# Altium schematic sheet LVDS_IFCA.SchDoc: LVDS Interface
size 420 x 297 mm; Author: G.K.; CompanyName: WUT; DrawnBy: G.K.; Organization: CERN; Address1: Warsaw Univeristy of Technology; Address2: Nowowiejska 15/19; DocumentNumber: 4; Revision: -; SheetNumber: 4; SheetTotal: 5; EDA_Number: ARTIQ; Projet: 3U ADC (Sampler); ModifiedBy: -; CreateDate: XX/XX/XXXX; CheckedDate: -; Title2: I2C logic v1.2; DivGrp: ISE; Designer: G.K.; ModifiedDate: -; ProjectName: 3U ADC (Sampler)
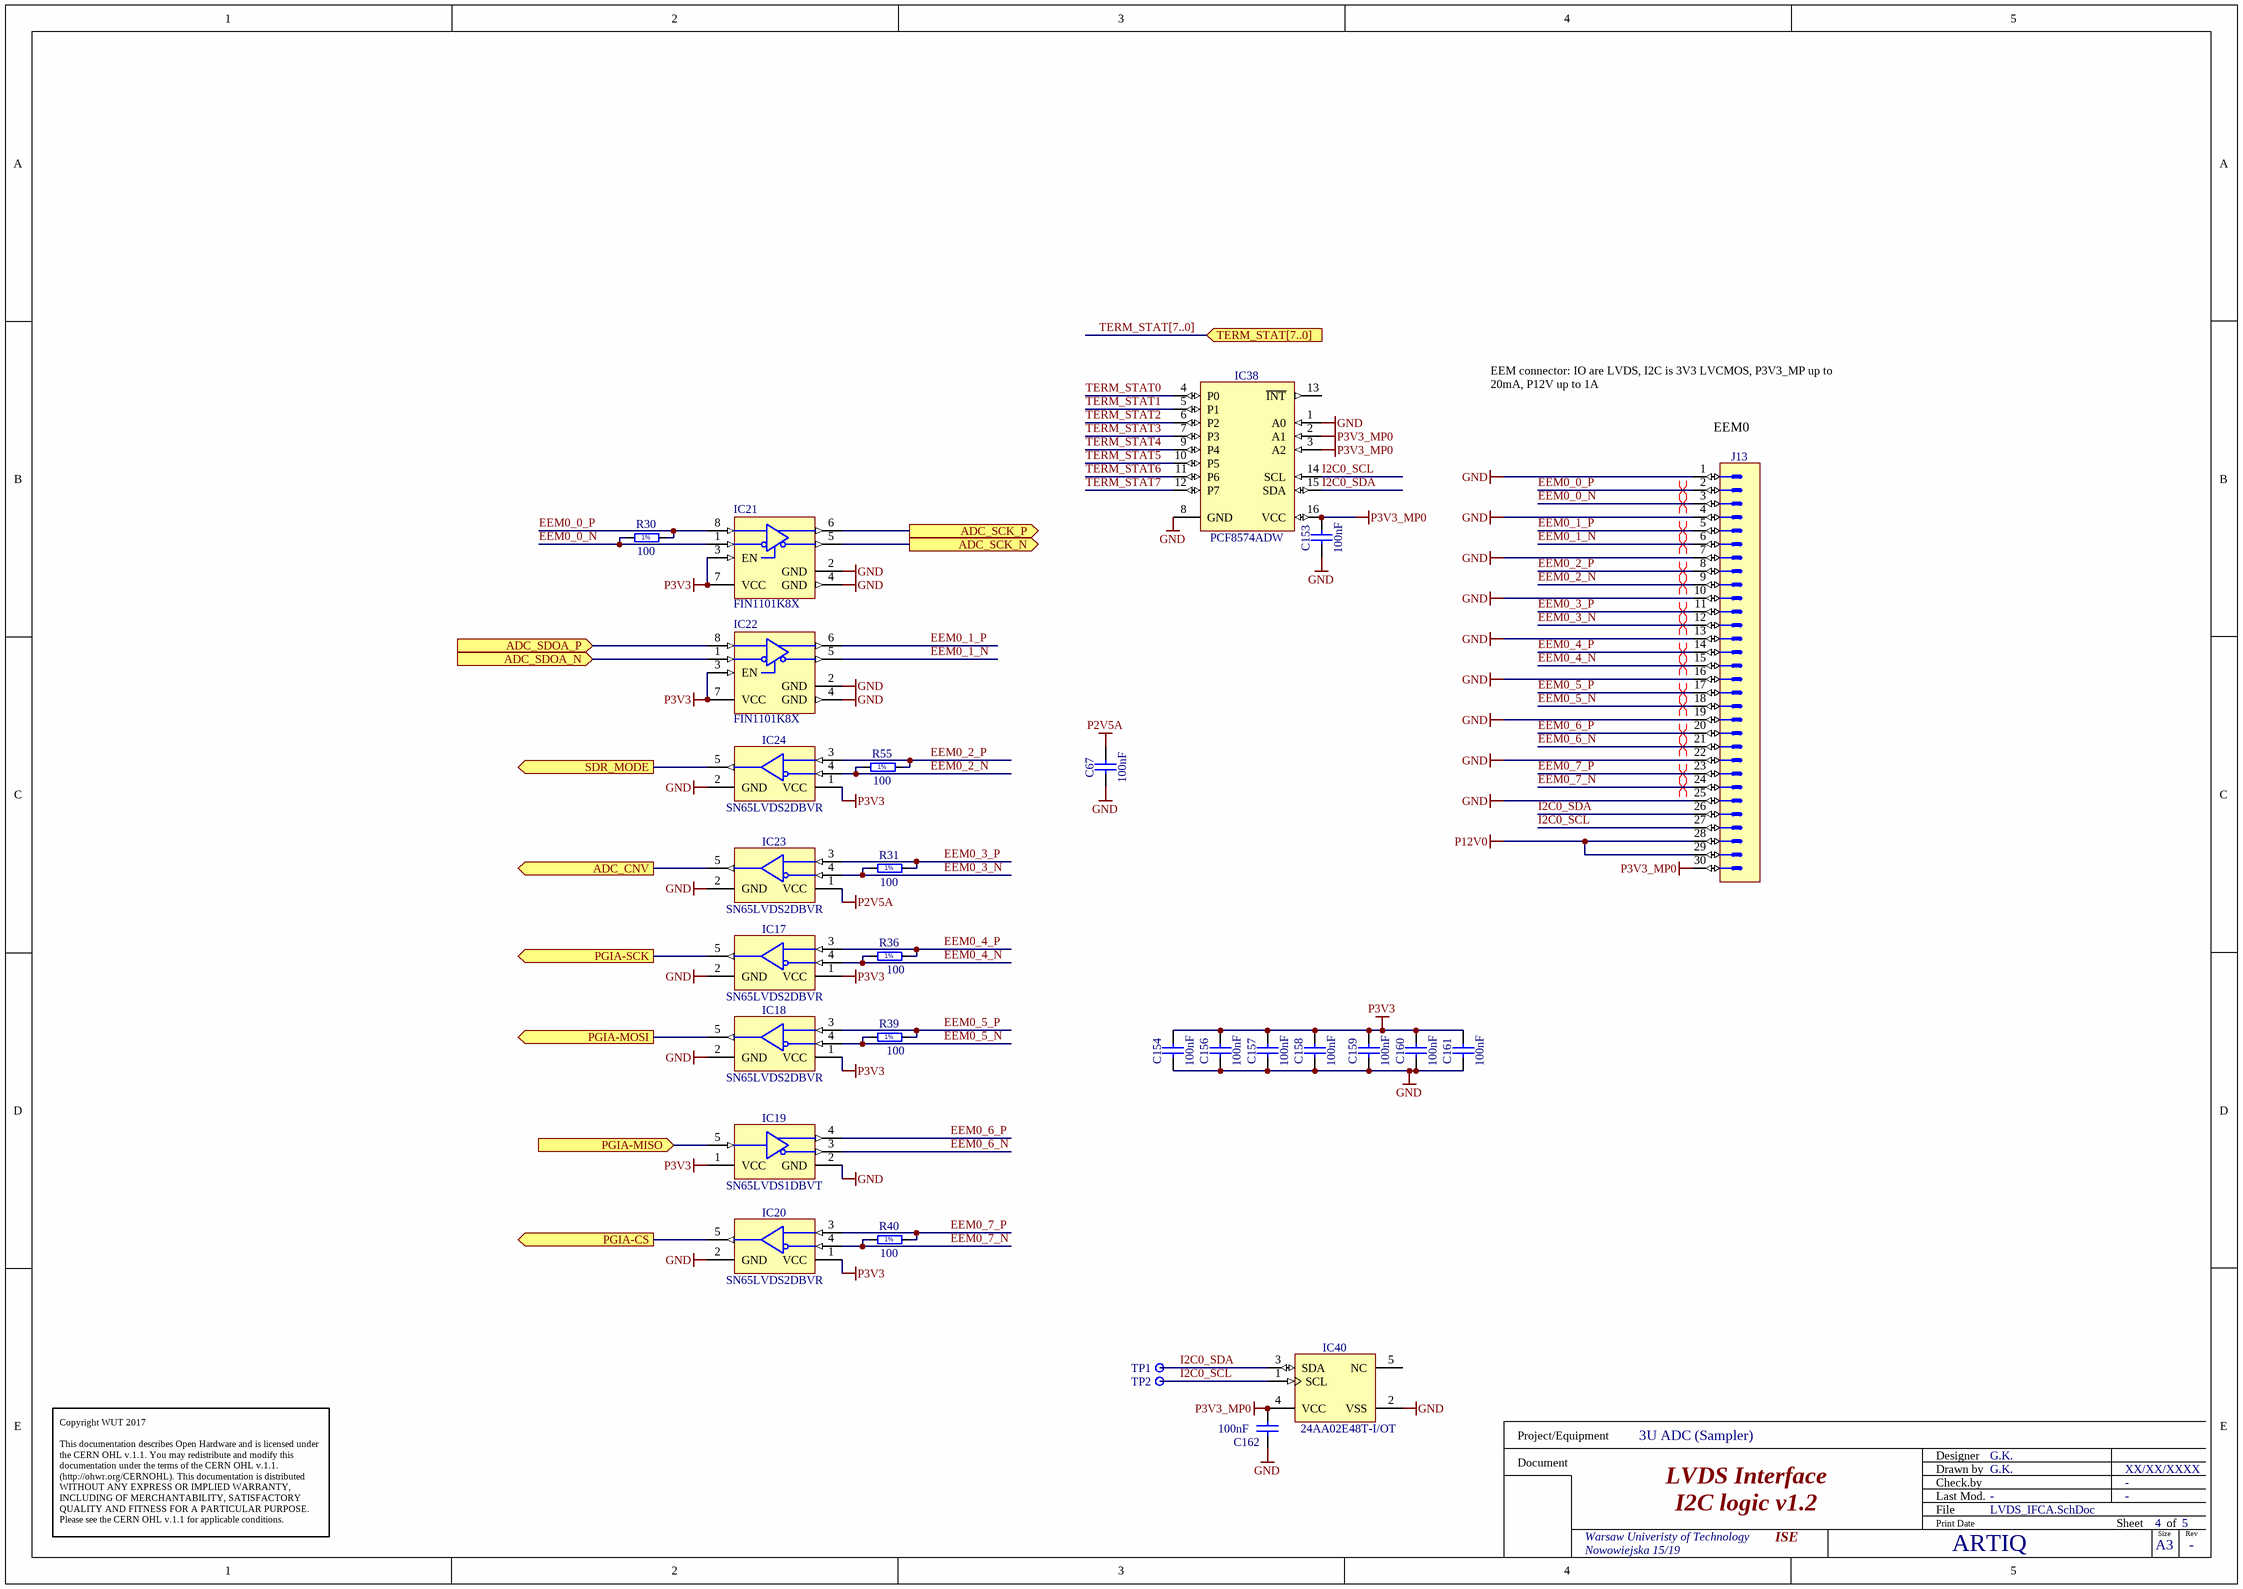
[diagram p0: LVDS_IFCA.SchDoc]

## Parts
C67  100nF  [CAPC1005X55N]
C153  100nF  [CAPC1005X55N]
C154  100nF  [CAPC1005X55N]
C156  100nF  [CAPC1005X55N]
C157  100nF  [CAPC1005X55N]
C158  100nF  [CAPC1005X55N]
C159  100nF  [CAPC1005X55N]
C160  100nF  [CAPC1005X55N]
C161  100nF  [CAPC1005X55N]
C162  100nF  [CAPC1005X55N]
IC17  SN65LVDS2DBVR  [SOT95P280X145-5N]
IC18  SN65LVDS2DBVR  [SOT95P280X145-5N]
IC19  SN65LVDS1DBVT  [SOT95P280X145-5N]
IC20  SN65LVDS2DBVR  [SOT95P280X145-5N]
IC21  FIN1101K8X  [SOP50P310X90-8N]
IC22  FIN1101K8X  [SOP50P310X90-8N]
IC23  SN65LVDS2DBVR  [SOT95P280X145-5N]
IC24  SN65LVDS2DBVR  [SOT95P280X145-5N]
IC38  PCF8574ADW  [SOIC127P1030X265-16N]
IC40  24AA02E48T-I/OT  [SOT95P280X145-5N]
J13  (no value)  [3M_N2530-6002RB]
R30  100  [RESC1005X40N]
R31  100  [RESC1005X40N]
R36  100  [RESC1005X40N]
R39  100  [RESC1005X40N]
R40  100  [RESC1005X40N]
R55  100  [RESC1005X40N]
TP1  Test Point  [TPS127]  (value not drawn)
TP2  Test Point  [TPS127]  (value not drawn)

## Ports
ADC_CNV (out), ADC_SCK_N (out), ADC_SCK_P (out), ADC_SDOA_N (in), ADC_SDOA_P (in), PGIA-CS (out), PGIA-MISO (in), PGIA-MOSI (out), PGIA-SCK (out), SDR_MODE (out), TERM_STAT[7..0] (in)

## Nets
GND: C67.1 C153.1 C154.1 C156.1 C157.1 C158.1 C159.1 C160.1 C161.1 C162.1 IC17.2(GND) IC18.2(GND) IC19.2(GND) IC20.2(GND) IC21.2(GND) IC21.4(GND) IC22.2(GND) IC22.4(GND) IC23.2(GND) IC24.2(GND) IC38.1(A0) IC38.8(GND) IC40.2(VSS) J13.1 J13.4 J13.7 J13.10 J13.13 J13.16 J13.19 J13.22 J13.25
P2V5A: C67.2 IC23.1(VCC)
P3V3: C154.2 C156.2 C157.2 C158.2 C159.2 C160.2 C161.2 IC17.1(VCC) IC18.1(VCC) IC19.1(VCC) IC20.1(VCC) IC21.3(EN) IC21.7(VCC) IC22.3(EN) IC22.7(VCC) IC24.1(VCC)
P3V3_MP0: C153.2 C162.2 IC38.2(A1) IC38.3(A2) IC38.16(VCC) IC40.4(VCC) J13.30
P12V0: J13.28 J13.29
ADC_CNV: IC23.5(R) ; port ADC_CNV
ADC_SCK_N: IC21.5(DOUT-) ; port ADC_SCK_N
ADC_SCK_P: IC21.6(DOUT+) ; port ADC_SCK_P
ADC_SDOA_N: IC22.1(RIN-) ; port ADC_SDOA_N
ADC_SDOA_P: IC22.8(RIN+) ; port ADC_SDOA_P
EEM0_0_N: IC21.1(RIN-) J13.3 R30.1
EEM0_0_P: IC21.8(RIN+) J13.2 R30.2
EEM0_1_N: IC22.5(DOUT-) J13.6
EEM0_1_P: IC22.6(DOUT+) J13.5
EEM0_2_N: IC24.4(B) J13.9 R55.1
EEM0_2_P: IC24.3(A) J13.8 R55.2
EEM0_3_N: IC23.4(B) J13.12 R31.1
EEM0_3_P: IC23.3(A) J13.11 R31.2
EEM0_4_N: IC17.4(B) J13.15 R36.1
EEM0_4_P: IC17.3(A) J13.14 R36.2
EEM0_5_N: IC18.4(B) J13.18 R39.1
EEM0_5_P: IC18.3(A) J13.17 R39.2
EEM0_6_N: IC19.3(A) J13.21
EEM0_6_P: IC19.4(B) J13.20
EEM0_7_N: IC20.4(B) J13.24 R40.1
EEM0_7_P: IC20.3(A) J13.23 R40.2
I2C0_SCL: IC38.14(SCL) IC40.1(SCL) J13.27 TP2.1
I2C0_SDA: IC38.15(SDA) IC40.3(SDA) J13.26 TP1.1
PGIA-CS: IC20.5(R) ; port PGIA-CS
PGIA-MISO: IC19.5(R) ; port PGIA-MISO
PGIA-MOSI: IC18.5(R) ; port PGIA-MOSI
PGIA-SCK: IC17.5(R) ; port PGIA-SCK
SDR_MODE: IC24.5(R) ; port SDR_MODE
TERM_STAT0: IC38.4(P0)
TERM_STAT1: IC38.5(P1)
TERM_STAT2: IC38.6(P2)
TERM_STAT3: IC38.7(P3)
TERM_STAT4: IC38.9(P4)
TERM_STAT5: IC38.10(P5)
TERM_STAT6: IC38.11(P6)
TERM_STAT7: IC38.12(P7)

Not connected (* = marked no-connect by the designer): IC38 13(~{INT}); IC40 5(NC)

## Buses and harness runs
bus TERM_STAT[7..0] = port TERM_STAT[7..0]

## Layout directives
differential pair: EEM0_0_N, EEM0_0_P, EEM0_1_N, EEM0_1_P, EEM0_2_N, EEM0_2_P, EEM0_3_N, EEM0_3_P, EEM0_4_N, EEM0_4_P, EEM0_5_N, EEM0_5_P, EEM0_6_N, EEM0_6_P, EEM0_7_N, EEM0_7_P

## Notes on the sheet
- (near J13) EEM connector: IO are LVDS, I2C is 3V3 LVCMOS, P3V3_MP up to 20mA, P12V up to 1A
- (near J13) EEM0
- Copyright WUT 2017
  This documentation describes Open Hardware and is licensed under the CERN OHL v.1.1. You may redistribute and modify this documentation under the terms of the CERN OHL v.1.1. (http://ohwr.org/CERNOHL). This documentation is distributed WITHOUT ANY EXPRESS OR IMPLIED WARRANTY, INCLUDING OF MERCHANTABILITY, SATISFACTORY QUALITY AND FITNESS FOR A PARTICULAR PURPOSE. Please see the CERN OHL v.1.1 for applicable conditions.
- Project/Equipment
- Document
- Designer
- Drawn by
- Check.by
- File
- Last Mod.
- Print Date
- Sheet
- Size
- A3
- of
- Rev
- (in symbol R0402_100R_1%_0.1W_100PPM) 1%

## Library data of the parts
C67 C153 C154 C156-C162 = CC0402_100NF_16V_10%_X5R: Non-polarised capacitor; Part Description: SMD Multilayer Chip Ceramic Capacitor; Manufacturer: GENERIC; Manufacturer1 Part Number: GRM155R61C104KA88D; Voltage: 16V; TC: X5R; Tolerance: ±10%; Part Number: CC0402_100NF_16V_10%_X5R; Component Kind: Standard; Component Type: Standard; Pin Count: 2; Value: 100nF; Status: None; Manufacturer Part Number: CC0402_100NF_16V_10%_X5R; Case: 0402; Mounted: Yes; Socket: No; SMD: Yes; Sense: No; Manufacturer1 Example: MURATA; Manufacturer1 ComponentHeight: 0.55mm; HelpURL: \\cern.ch\dfs\Applications\Altium\Datasheets\CC0402_X5R_MURATA_GRM.pdf; Author: CERN DEM JLC; CreateDate: 10.12.2013; LatestRevisionDate: 10.12.2013
IC17 IC18 IC20 IC23 IC24 = SN65LVDS2DBVR: High-Speed Differential Line Receiver; Manufacturer: TEXAS INSTRUMENTS; PressFit: No; Bonding: No; Part Number: SN65LVDS2DBVR; Component Kind: Standard; Component Type: Standard; Device: SN65LVDS2DBVR; PackageDescription: SOT, 0.95mm pitch; 5 pin, 1.60mm W X 2.90mm L X 1.45mm H body, IPC Medium Density; Part Description: High-Speed Differential Line Receiver; Manufacturer Part Number: SN65LVDS2DBVR; Pin Count: 5; Case: SOT23-5; Mounted: Yes; Socket: No; SMD: Yes; Sense: No; ComponentHeight: 1.45mm; Author: CERN DEM JLC; HelpURL: \\cern.ch\dfs\Applications\Altium\Datasheets\SN65LVDS2DBVR.pdf; CreateDate: 03.03.2011; LatestRevisionDate: 22.09.2011
IC19 = SN65LVDS1DBVT: High-Speed Differential Line Driver; Manufacturer: TEXAS INSTRUMENTS; PressFit: No; Bonding: No; Part Number: SN65LVDS1DBVT; Component Kind: Standard; Component Type: Standard; Device: SN65LVDS1DBVT; PackageDescription: SOT, 0.95mm pitch; 5 pin, 1.60mm W X 2.90mm L X 1.45mm H body, IPC Medium Density; Part Description: High-Speed Differential Line Driver; Manufacturer Part Number: SN65LVDS1DBVT; Pin Count: 5; Case: SOT23-5; Mounted: Yes; Socket: No; SMD: Yes; Sense: No; ComponentHeight: 1.45mm; Author: CERN DEM JLC; HelpURL: \\cern.ch\dfs\Applications\Altium\Datasheets\SN65LVDS1DBVT.pdf; CreateDate: 22.09.2011; LatestRevisionDate: 22.09.2011
IC21 IC22 = FIN1101K8X: LVDS Single Port High Speed Repeater; Manufacturer: FAIRCHILD SEMICONDUCTOR; PressFit: No; Bonding: No; Part Number: FIN1101K8X; Component Kind: Standard; Component Type: Standard; Device: FIN1101K8X; PackageDescription: SOP, 0.50mm Pitch; 8 pin, 2.30mm W X 2.00mm L X 0.90mm H body, PC Medium Density; Part Description: LVDS Single Port High Speed Repeater; Manufacturer Part Number: FIN1101K8X; Pin Count: 8; Case: TSSOP8; Mounted: Yes; Socket: No; SMD: Yes; Sense: No; ComponentHeight: 0.8mm; Author: CERN DEM JLC; HelpURL: \\cern.ch\dfs\Applications\Altium\Datasheets\FIN1101K8X.pdf; CreateDate: 08.11.2016; LatestRevisionDate: 08.11.2016
IC38 = PCF8574ADW: Remote 8-bit I/O Expander For I2C Bus; Manufacturer: TEXAS INSTRUMENTS; PressFit: No; Bonding: No; Part Number: PCF8574ADW; Component Kind: Standard; Component Type: Standard; Device: PCF8574ADW; PackageDescription: SOIC 16, Pitch 1.27mm - Body 7.5x10.3mm, IPC Medium Density; Part Description: Remote 8-bit I/O Expander For I2C Bus; Manufacturer Part Number: PCF8574ADW; Pin Count: 16; Case: SOIC16W; Mounted: Yes; Socket: No; SMD: Yes; Sense: No; ComponentHeight: 2.65mm; Author: CERN DEM JLC; HelpURL: \\cern.ch\dfs\Applications\Altium\Datasheets\PCF8574ADW.pdf; CreateDate: 01.11.2012; LatestRevisionDate: 01.11.2012
IC40 = 24AA02E48T-I/OT: 1.7V-5.5V, 2K I2C Serial EEPROM With EUI-48 Node Identity; Manufacturer: MICROCHIP TECHNOLOGY; PressFit: No; Bonding: No; Part Number: 24AA02E48T-I/OT; Component Kind: Standard; Component Type: Standard; Device: 24AA02E48T-I/OT; PackageDescription: SOT, 0.95mm pitch; 5 pin, 1.60mm W X 2.90mm L X 1.45mm H body, IPC Medium Density; Part Description: 1.7V-5.5V, 2K I2C Serial EEPROM With EUI-48 Node Identity; Manufacturer Part Number: 24AA02E48T-I/OT; Pin Count: 5; Case: SOT23-5; Mounted: Yes; Socket: No; SMD: Yes; Sense: No; ComponentHeight: 1.45mm; HelpURL: \\cern.ch\dfs\Applications\Altium\Datasheets\24AA02E48T-I-OT.pdf; Author: CERN DEM MR; CreateDate: 31.03.2016; LatestRevisionDate: 31.03.2016
J13 = 3M_N2530-6002RB: Connector 30 Male; Part Description: 30 Contacts - Straight .100'' x .100'' Low Profile Four-Wall Header, 2500 Series; Manufacturer: 3M; PressFit: No; Part Number: 3M_N2530-6002RB; Component Kind: Standard; Component Type: Standard; Pin Count: 30; Family: Header 30; Mounted: Yes; Socket: No; SMD: No; Sense: No; Status: None; Manufacturer Part Number: N2530-6002RB; ComponentHeight: 10.03mm; HelpURL: \\cern.ch\dfs\Applications\Altium\Datasheets\3M_N2530-6002RB.pdf; Author: CERN DEM JLC; CreateDate: 11.02.2009; LatestRevisionDate: 11.08.2009
R30 R31 R36 R39 R40 R55 = R0402_100R_1%_0.1W_100PPM: Resistor - 1%; Part Description: General Purpose Thick Film Chip Resistor; Manufacturer: GENERIC; Manufacturer Part Number: R0402_100R_1%_0.1W_100PPM_50V; Manufacturer1 Part Number: ERJ2RKF1000X; Power: 0.1W; TC: ±100ppm/°C; Voltage: 50V; Part Number: R0402_100R_1%_0.1W_100PPM; Component Kind: Standard; Component Type: Standard; Pin Count: 2; Value: 100; Status: Not recommended; Tolerance: ±1%; Case: 0402; Mounted: Yes; Sense: No; Socket: No; SMD: Yes; Manufacturer1 Example: PANASONIC; Manufacturer1 ComponentHeight: 0.4mm; HelpURL: \\cern.ch\dfs\Applications\Altium\Datasheets\R0402_PANASONIC_ERJ2RK.pdf; Author: CERN DEM JLC; CreateDate: 12.12.2013; LatestRevisionDate: 03.03.2015
TP1 TP2 = SMD_PAD_1.27X1.27MM: Part Description: 1.27mm x 1.27mm PCB Copper Area (SMD Test Point); Mounted: No; Part Number: SMD_PAD_1.27X1.27MM; Component Kind: Standard (No BOM); Component Type: Standard (No BOM); Pin Count: 1; Family: Test Point; Socket: No; SMD: Yes; Sense: No; Status: None; ComponentHeight: 0mm; HelpURL: Undefined; Author: CERN DEM JLC; CreateDate: 12.01.2008; LatestRevisionDate: 12.01.2008; PackageDescription: 1.27mm x 1.27mm PCB Copper Area (SMD Test Point)